# Altium project SAMV71_Xplained_Ultra.PrjPCB (part 2 of 4)

## Sheet SAMV71_Xplained_Ultra_Connectors.SchDoc: Extension connectors
size A3; Organization: ATMEL Norway; Address1: Vestre Rosten 79; Address2: N-7075 TILLER; Address3: NORWAY; DocumentNumber: A09-2407; Revision: 2; SheetNumber: 7; SheetTotal: 13; PageSetup: Record=PageOptions|CenterHorizontal=True|CenterVertical=True|PrintScale=1.01|XCorrection=1.00|YCorrection=1.00|PrintKind=1|BorderSize=5000000|LeftOffset=0|BottomOffset=0|Orientation=2|PaperLength=1000|PaperWidth=1000|Scale=100|PaperSource=7|PrintQuality=-4|MediaType=1|DitherType=10|PrintScaleMode=1|PaperKind=A3 (297 x 420 mm)|PaperIndex=9
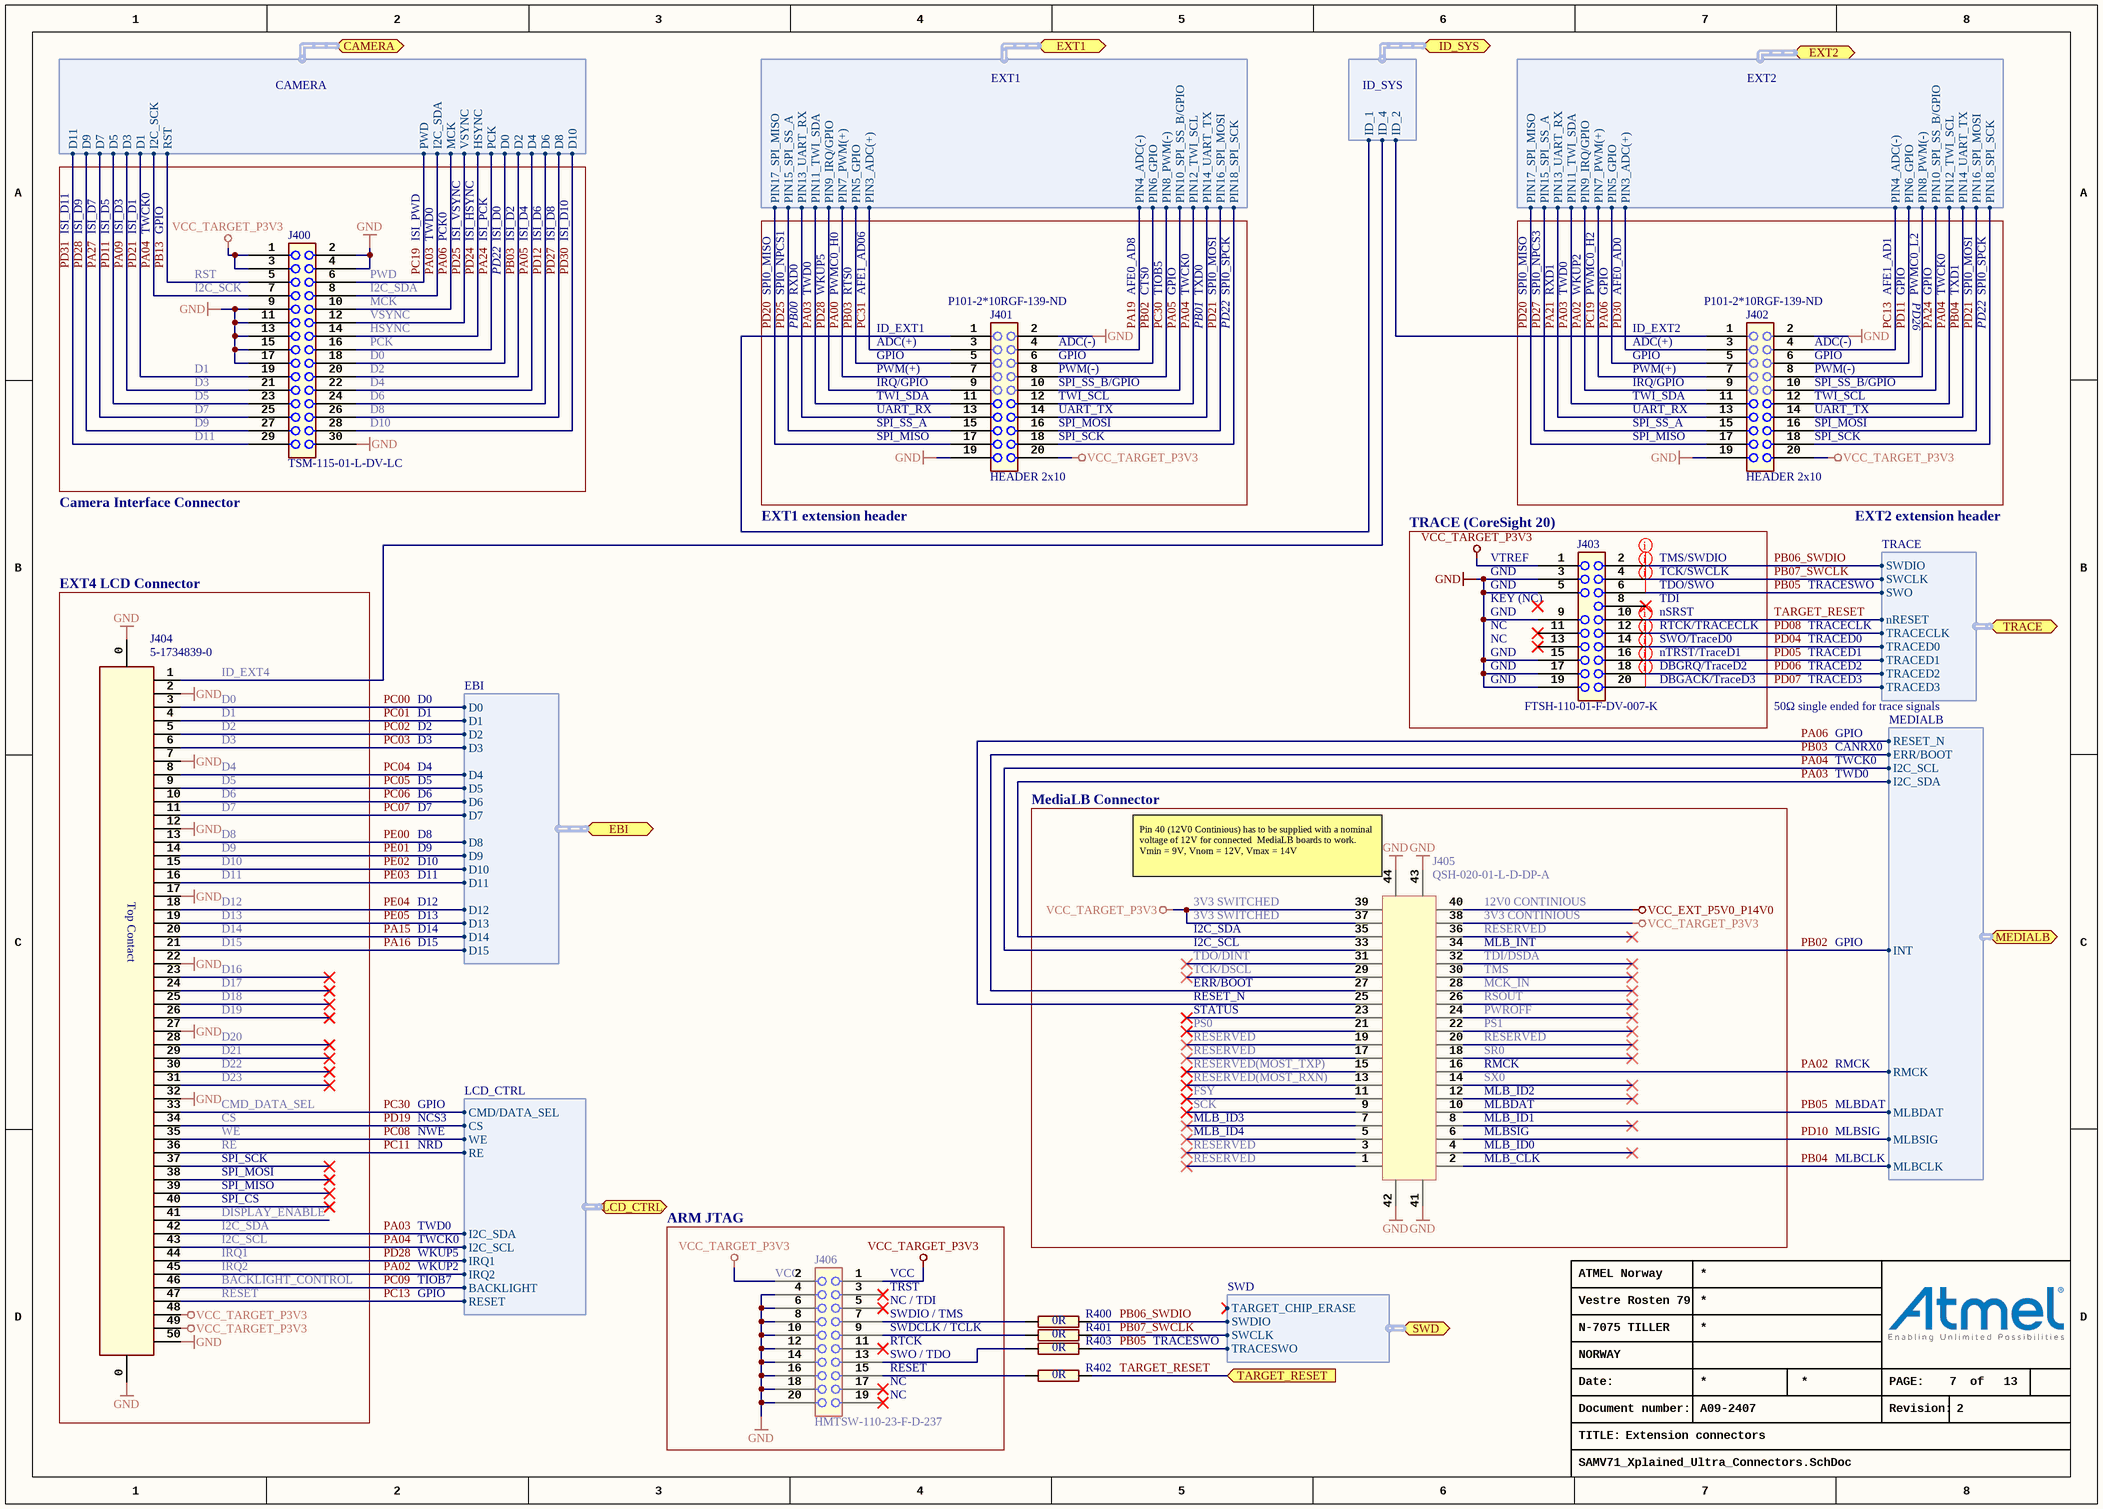
[diagram p3: SAMV71_Xplained_Ultra_Connectors.SchDoc]

### Parts
J400  value TSM-115-01-L-DV-LC  [AP8-00884]  (hidden comment: HEADER 2x15)
J401  HEADER 2x10  value P101-2*10RGF-139-ND  [AP8-00622]
J402  HEADER 2x10  value P101-2*10RGF-139-ND  [AP8-00622]
J403  FTSH-110-01-F-DV-007-K  [AP8-00910]
J404  value 5-1734839-0  [AP8-00774]  (hidden comment: Used for Xplained Pro MCU board on top layer.)
J405  value QSH-020-01-L-D-DP-A  [AP8-00878]
J406  value HMTSW-110-23-F-D-237  [AP8-00744]  (hidden comment: Same as A08-1514 but with 1mm hole)
R400  value 0R  [AP2-00000]  (hidden comment: R2)
R401  value 0R  [AP2-00000]  (hidden comment: R2)
R402  value 0R  [AP2-00000]  (hidden comment: R2)
R403  value 0R  [AP2-00000]  (hidden comment: R2)

### Blocks framed on the sheet
TRACE (CoreSight 20): J403
EXT4 LCD Connector: J404
MediaLB Connector: J405
ARM JTAG: J406

### Ports
CAMERA (harness CAMERA), EBI (harness EBI), EXT1 (harness EXT1), EXT2 (harness EXT2), ID_SYS (harness ID_SYS), LCD_CTRL (harness LCD_CTRL), MEDIALB (harness MEDIALB), SWD (harness SWD), TARGET_RESET (in), TRACE (harness TRACE)

### Harnesses
ID_SYS: ID_1, ID_2, ID_4
EXT1: PIN3_ADC(+), PIN4_ADC(-), PIN5_GPIO, PIN6_GPIO, PIN7_PWM(+), PIN8_PWM(-), PIN9_IRQ/GPIO, PIN10_SPI_SS_B/GPIO, PIN11_TWI_SDA, PIN12_TWI_SCL, PIN13_UART_RX, PIN14_UART_TX, PIN15_SPI_SS_A, PIN16_SPI_MOSI, PIN17_SPI_MISO, PIN18_SPI_SCK
EXT2: PIN3_ADC(+), PIN4_ADC(-), PIN5_GPIO, PIN6_GPIO, PIN7_PWM(+), PIN8_PWM(-), PIN9_IRQ/GPIO, PIN10_SPI_SS_B/GPIO, PIN11_TWI_SDA, PIN12_TWI_SCL, PIN13_UART_RX, PIN14_UART_TX, PIN15_SPI_SS_A, PIN16_SPI_MOSI, PIN17_SPI_MISO, PIN18_SPI_SCK
EBI: D0, D1, D2, D3, D4, D5, D6, D7, D8, D9, D10, D11, D12, D13, D14, D15
CAMERA: MCK, VSYNC, HSYNC, PCK, D0, D1, D2, D3, D4, D5, D6, D7, D8, D9, D10, D11, I2C_SCK, I2C_SDA, RST, PWD
TRACE: SWDIO, SWCLK, TRACECLK, TRACED0, TRACED1, TRACED2, TRACED3, nRESET, SWO
LCD_CTRL: CMD/DATA_SEL, CS, WE, RE, I2C_SDA, I2C_SCL, IRQ1, IRQ2, BACKLIGHT, RESET
MEDIALB: MLBSIG, MLBDAT, MLBCLK, I2C_SDA, I2C_SCL, INT, ERR/BOOT, RESET_N, RMCK
SWD: SWCLK, SWDIO, TARGET_CHIP_ERASE, TRACESWO

### Nets
GND: J400.2 J400.4 J400.9 J400.11 J400.13 J400.15 J400.17 J400.30 J401.2 J401.19 J402.2 J402.19 J403.3 J403.5 J403.9 J403.15 J403.17 J403.19 J404.0 J404.2 J404.7 J404.12 J404.17 J404.22 J404.27 J404.32 J404.50 J405.41 J405.42 J405.43 J405.44 J406.4 J406.6 J406.8 J406.10 J406.12 J406.14 J406.16 J406.18 J406.20
VCC_EXT_P5V0_P14V0: J405.40
VCC_TARGET_P3V3: J400.1 J400.3 J401.20 J402.20 J403.1 J404.48 J404.49 J405.37 J405.38 J405.39 J406.1 J406.2
ID1: J401.1 ; port ID_SYS.ID_1
ID2: J402.1 ; port ID_SYS.ID_2
ID4: J404.1 ; port ID_SYS.ID_4
PA00: J401.7 ; port EXT1.PIN7_PWM(+)
PA02: J402.9 J404.45 J405.16 ; port EXT2.PIN9_IRQ/GPIO, port LCD_CTRL.IRQ2, port MEDIALB.RMCK
PA03: J400.8 J401.11 J402.11 J404.42 J405.35 ; port EXT1.PIN11_TWI_SDA, port EXT2.PIN11_TWI_SDA, port CAMERA.I2C_SDA, port LCD_CTRL.I2C_SDA, port MEDIALB.I2C_SDA
PA04: J400.7 J401.12 J402.12 J404.43 J405.33 ; port EXT1.PIN12_TWI_SCL, port EXT2.PIN12_TWI_SCL, port CAMERA.I2C_SCK, port LCD_CTRL.I2C_SCL, port MEDIALB.I2C_SCL
PA05: J400.22 J401.10 ; port EXT1.PIN10_SPI_SS_B/GPIO, port CAMERA.D4
PA06: J400.10 J402.5 J405.25 ; port EXT2.PIN5_GPIO, port CAMERA.MCK, port MEDIALB.RESET_N
PA09: J400.21 ; port CAMERA.D3
PA15: J404.20 ; port EBI.D14
PA16: J404.21 ; port EBI.D15
PA19: J401.4 ; port EXT1.PIN4_ADC(-)
PA21: J402.13 ; port EXT2.PIN13_UART_RX
PA24: J400.16 J402.10 ; port EXT2.PIN10_SPI_SS_B/GPIO, port CAMERA.PCK
PA27: J400.25 ; port CAMERA.D7
PB02: J401.6 J405.34 ; port EXT1.PIN6_GPIO, port MEDIALB.INT
PB03: J400.20 J401.5 J405.27 ; port EXT1.PIN5_GPIO, port CAMERA.D2, port MEDIALB.ERR/BOOT
PB04: J402.14 J405.2 ; port EXT2.PIN14_UART_TX, port MEDIALB.MLBCLK
PB05: J403.6 J405.10 R403.2 ; port TRACE.SWO, port MEDIALB.MLBDAT, port SWD.TRACESWO
PB06_SWDIO: J403.2 R400.2 ; port TRACE.SWDIO, port SWD.SWDIO
PB07_SWCLK: J403.4 R401.2 ; port TRACE.SWCLK, port SWD.SWCLK
PB13: J400.5 ; port CAMERA.RST
PC00: J404.3 ; port EBI.D0
PC01: J404.4 ; port EBI.D1
PC02: J404.5 ; port EBI.D2
PC03: J404.6 ; port EBI.D3
PC04: J404.8 ; port EBI.D4
PC05: J404.9 ; port EBI.D5
PC06: J404.10 ; port EBI.D6
PC07: J404.11 ; port EBI.D7
PC08: J404.35 ; port LCD_CTRL.WE
PC09: J404.46 ; port LCD_CTRL.BACKLIGHT
PC11: J404.36 ; port LCD_CTRL.RE
PC13: J402.4 J404.47 ; port EXT2.PIN4_ADC(-), port LCD_CTRL.RESET
PC19: J400.6 J402.7 ; port EXT2.PIN7_PWM(+), port CAMERA.PWD
PC30: J401.8 J404.33 ; port EXT1.PIN8_PWM(-), port LCD_CTRL.CMD/DATA_SEL
PC31: J401.3 ; port EXT1.PIN3_ADC(+)
PD04: J403.14 ; port TRACE.TRACED0
PD05: J403.16 ; port TRACE.TRACED1
PD06: J403.18 ; port TRACE.TRACED2
PD07: J403.20 ; port TRACE.TRACED3
PD08: J403.12 ; port TRACE.TRACECLK
PD10: J405.6 ; port MEDIALB.MLBSIG
PD11: J400.23 J402.6 ; port EXT2.PIN6_GPIO, port CAMERA.D5
PD12: J400.24 ; port CAMERA.D6
PD19: J404.34 ; port LCD_CTRL.CS
PD20: J401.17 J402.17 ; port EXT1.PIN17_SPI_MISO, port EXT2.PIN17_SPI_MISO
PD21: J400.19 J401.16 J402.16 ; port EXT1.PIN16_SPI_MOSI, port EXT2.PIN16_SPI_MOSI, port CAMERA.D1
PD24: J400.14 ; port CAMERA.HSYNC
PD25: J400.12 J401.15 ; port EXT1.PIN15_SPI_SS_A, port CAMERA.VSYNC
PD27: J400.26 J402.15 ; port EXT2.PIN15_SPI_SS_A, port CAMERA.D8
PD28: J400.27 J401.9 J404.44 ; port EXT1.PIN9_IRQ/GPIO, port CAMERA.D9, port LCD_CTRL.IRQ1
PD30: J400.28 J402.3 ; port EXT2.PIN3_ADC(+), port CAMERA.D10
PD31: J400.29 ; port CAMERA.D11
PE00: J404.13 ; port EBI.D8
PE01: J404.14 ; port EBI.D9
PE02: J404.15 ; port EBI.D10
PE03: J404.16 ; port EBI.D11
PE04: J404.18 ; port EBI.D12
PE05: J404.19 ; port EBI.D13
TARGET_RESET: J403.10 R402.2 ; port TARGET_RESET, port TRACE.nRESET
NetJ400_18: J400.18 ; port CAMERA.D0
NetJ401_13: J401.13 ; port EXT1.PIN13_UART_RX
NetJ401_14: J401.14 ; port EXT1.PIN14_UART_TX
NetJ401_18: J401.18 ; port EXT1.PIN18_SPI_SCK
NetJ402_8: J402.8 ; port EXT2.PIN8_PWM(-)
NetJ402_18: J402.18 ; port EXT2.PIN18_SPI_SCK
NetJ406_7: J406.7 R400.1
NetJ406_9: J406.9 R401.1
NetJ406_13: J406.13 R403.1
NetJ406_15: J406.15 R402.1

Not connected (* = marked no-connect by the designer): J403 8* 11* 13*; J404 23* 24* 25* 26* 28* 29* 30* 31* 37* 38* 39* 40* 41; J405 1* 3* 4* 5* 7* 8* 9* 11* 12* 13* 14* 15* 17* 18* 19* 20* 21* 22* 23* 24* 26* 28* 29* 30* 31* 32* 36*; J406 3* 5* 11* 17* 19*

### Layout directives
net class TRACE: PB05, PB06_SWDIO, PB07_SWCLK, PD04, PD05, PD06, PD07, PD08

### Notes on the sheet
- ISI_D11
- ISI_D9
- ISI_D7
- ISI_D5
- ISI_D3
- ISI_D1
- TWCK0
- GPIO
- ISI_PWD
- TWD0
- PCK0
- ISI_VSYNC
- ISI_HSYNC
- ISI_PCK
- ISI_D0
- ISI_D2
- ISI_D4
- ISI_D6
- ISI_D8
- ISI_D10
- RST
- (near J400) I2C_SCK
- PWD
- I2C_SDA
- MCK
- VSYNC
- PD22
- SPI0_MISO
- SPI0_NPCS1
- RXD0
- WKUP5
- PWMC0_H0
- RTS0
- AFE1_AD06
- AFE0_AD8
- CTS0
- TIOB5
- TXD0
- SPI0_MOSI
- SPI0_SPCK
- SPI0_NPCS3
- RXD1
- WKUP2
- PWMC0_H2
- AFE0_AD0
- AFE1_AD1
- PD26
- PWMC0_L2
- TXD1
- D1
- HSYNC
- PCK
- D0
- D2
- PB00
- ID_EXT1
- ADC(+)
- PWM(+)
- (near J401) ADC(-)
- (near J401) GPIO
- (near J401) PWM(-)
- PB01
- ID_EXT2
- (near J402) ADC(-)
- (near J402) GPIO
- (near J402) PWM(-)
- D3
- D5
- D7
- D9
- D11
- D4
- D6
- D8
- D10
- IRQ/GPIO
- TWI_SDA
- UART_RX
- SPI_SS_A
- SPI_MISO
- (near J401) SPI_SS_B/GPIO
- (near J401) TWI_SCL
- (near J401) UART_TX
- (near J401) SPI_MOSI
- (near J401) SPI_SCK
- (near J402) SPI_SS_B/GPIO
- (near J402) TWI_SCL
- (near J402) UART_TX
- (near J402) SPI_MOSI
- (near J402) SPI_SCK
- Camera Interface Connector
- EXT1 extension header
- VTREF
- GND
- TMS/SWDIO
- TCK/SWCLK
- TDO/SWO
- TRACESWO
- EXT2 extension header
- (near J403) KEY (NC)
- NC
- TDI
- nSRST
- SWO/TraceD0
- RTCK/TRACECLK
- TRACECLK
- TRACED0
- ID_EXT4
- nTRST/TraceD1
- DBGRQ/TraceD2
- DBGACK/TraceD3
- 50Ω single ended for trace signals
- TRACED1
- TRACED2
- TRACED3
- CANRX0
- D12
- D13
- (near J405) Pin 40 (12V0 Continious) has to be supplied with a nominal voltage of 12V for connected  MediaLB boards to work.  Vmin = 9V, Vnom = 12V, Vmax = 14V
- 3V3 SWITCHED
- (near J405) 3V3 CONTINIOUS
- (near J405) 12V0 CONTINIOUS
- D14
- D15
- D16
- D17
- TCK/DSCL
- TDO/DINT
- ERR/BOOT
- I2C_SCL
- (near J405) TMS
- (near J405) TDI/DSDA
- (near J405) RESERVED
- (near J405) MCK_IN
- (near J405) MLB_INT
- D18
- D19
- D20
- D21
- RESERVED
- PS0
- STATUS
- RESET_N
- (near J405) SR0
- (near J405) RSOUT
- (near J405) PWROFF
- (near J405) PS1
- D22
- D23
- CMD_DATA_SEL
- CS
- NCS3
- SCK
- FSY
- RESERVED(MOST_RXN)
- RESERVED(MOST_TXP)
- MLB_ID3
- (near J405) SX0
- (near J405) RMCK
- (near J405) MLBDAT
- (near J405) MLB_ID2
- (near J405) MLB_ID1
- RMCK
- MLBDAT
- WE
- RE
- SPI_MOSI
- SPI_SCK
- NWE
- NRD
- MLB_ID4
- (near J405) MLBSIG
- (near J405) MLB_ID0
- (near J405) MLB_CLK
- MLBSIG
- MLBCLK
- DISPLAY_ENABLE
- IRQ1
- SPI_CS
- IRQ2
- BACKLIGHT_CONTROL
- RESET
- TIOB7
- (near J406) VCC
- (near J406) TRST
- (near J406) NC / TDI
- (near J406) SWDIO / TMS
- SWDCLK / TCLK
- (near J406) RTCK
- (near J406) SWO / TDO
- (near J406) RESET
- (near J406) NC
- Date:
- PAGE:
- of
- TITLE:
- Document number:
- Revision:
- (in symbol A08-1886) Top Contact

### Library data of the parts
J400 = A08-2225: Samtec TSM series, 2x15 pin header, straight, 2.54mm pitch SMD, locking leads.; PartGroup: Mechanical devices,Connectors,Pin headers; TemperatureRange: -55Â°C to +125Â°C; AN: A08-2225; Height: 9,64999961853027
J401 J402 = A08-1513: Pin header, 2x10, Right Angle, 2.54mm, THM, Pin In Paste; PartGroup: Mechanical devices,Connectors,Pin headers; AN: A08-1513; MPN: P101-2*10RGF-139-ND
J403 = A08-2290: SAMTEC FTSH series 50-mil header, shrouded, pin 7 removed, SMD; PartGroup: Mechanical devices,Connectors,Pin headers; TemperatureRange: -55Â°C to +125Â°C; AN: A08-2290; Value: FTSH-110-01-F-DV-007-K; Height: 6,1100001335144
J404 = A08-1886: 50 pin FPC connector, e=0.5mm, single side contact (top).; PartGroup: Mechanical devices,Connectors,PCB - receptacle; Manufacturer: TE Connectivity; TemperatureRange: -20°C to +85°C; AN: A08-1886; Height: 2.04999995231628; MPN: 5-1734839-0
J405 = A08-2204: SAMTEC 0.5mm, 20-pair, High-Speed Differential Pair Socket; PartGroup: Mechanical devices,Connectors,PCB - receptacle; AN: A08-2204; Height: 3.04999995231628
J406 = A08-1801: 2x10 pin header, 2.54mm pitch, Pin-in-Paste THM, 1mm hole; PartGroup: Mechanical devices,Connectors,Pin headers; Manufacturer: SAMTEC; AN: A08-1801; Height: 6,09999990463257; MPN: HMTSW-110-23-F-D-237
R400-R403 = A02-0163: RES 0.0 OHM 1/16W 0402 SMD; PartGroup: Resistors,SMD,0402 1%; Manufacturer: (n/a); MPN: RMCF0402ZT0R00; Tolerance: 1 %; TemperatureRange: -55 - +125 deg C; AN: A02-0163; Height: 0,349999994039536

## Sheet SAMV71_Xplained_Ultra_Power_Supply.SchDoc: Power supply
size A3; Organization: ATMEL Norway; Address1: Vestre Rosten 79; Address2: N-7075 TILLER; Address3: NORWAY; DocumentNumber: A09-2407; Revision: 2; SheetNumber: 2; SheetTotal: 13; PageSetup: Record=PageOptions|CenterHorizontal=True|CenterVertical=True|PrintScale=1.01|XCorrection=1.00|YCorrection=1.00|PrintKind=1|BorderSize=5000000|LeftOffset=0|BottomOffset=0|Orientation=2|PaperLength=1000|PaperWidth=1000|Scale=100|PaperSource=7|PrintQuality=-4|MediaType=1|DitherType=10|PaperKind=A3 (297 x 420 mm)|PrintScaleMode=1
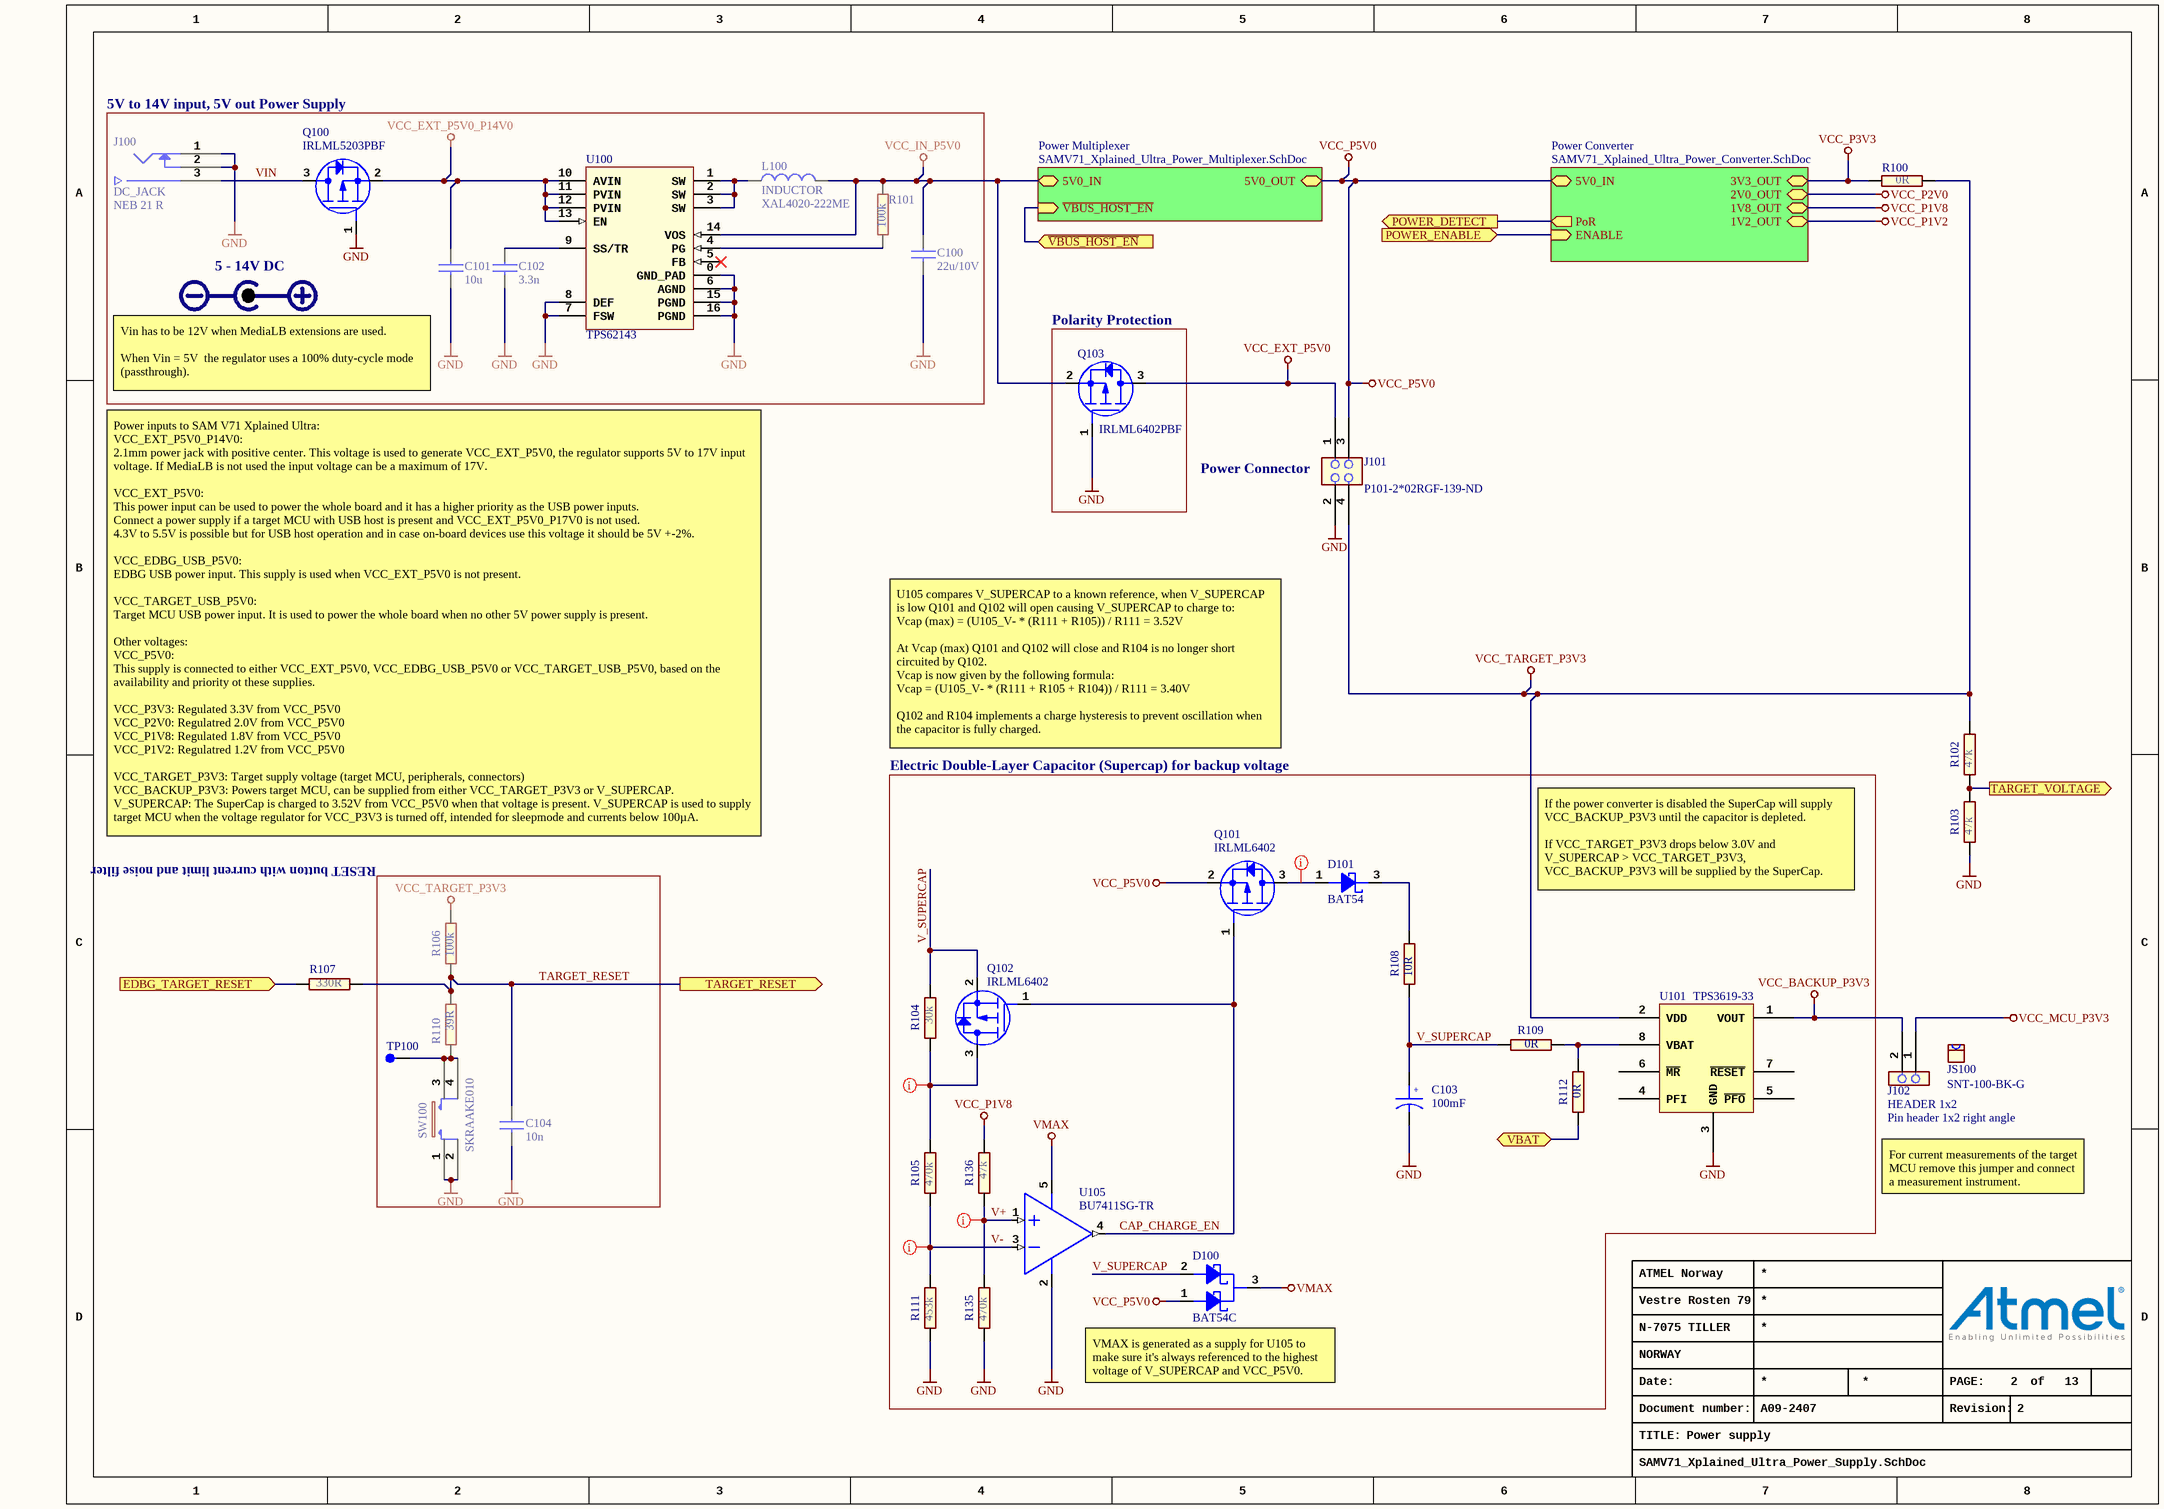
[diagram p4: SAMV71_Xplained_Ultra_Power_Supply.SchDoc]

### Parts
C100  value 22u/10V  [AP1-00003]  (hidden comment: CAP-NONPOL)
C101  value 10u  [AP1-00003]  (hidden comment: CAP-NONPOL)
C102  value 3.3n  [AP1-00001]  (hidden comment: CAP-NONPOL)
C103  value 100mF  [AP1-00122]  (hidden comment: For reflow soldering)
C104  10n  [AP1-00053]
D100  value BAT54C  [AP5-00002]  (hidden comment: DUAL_SCHOTTKY_123)
D101  value BAT54  [AP4-00007]  (hidden comment: SCHOTTKY_SMD_31)
J100  DC_JACK  value NEB 21 R  [AP8-00853]
J101  value P101-2*02RGF-139-ND  [AP8-00628]  (hidden comment: HEADER 2x2)
J102  HEADER 1x2  value Pin header 1x2 right angle  [AP8-00367]
JS100  value SNT-100-BK-G  [AP8-00525]
L100  INDUCTOR  value XAL4020-222ME  [AP3-00119]
Q100  value IRLML5203PBF  [AP5-00002]  (hidden comment: MOSFET_P_GSD)
Q101  value IRLML6402  [AP5-00002]  (hidden comment: MOSFET_P_GSD)
Q102  value IRLML6402  [AP5-00002]  (hidden comment: MOSFET_P_GSD)
Q103  value IRLML6402PBF  [AP5-00002]  (hidden comment: MOSFET_P_GSD)
R100  value 0R  [AP2-00000]  (hidden comment: R2)
R101  value 100k  [AP2-00000]  (hidden comment: R2)
R102  value 47k  [AP2-00000]  (hidden comment: R2)
R103  value 47k  [AP2-00000]  (hidden comment: R2)
R104  value 30k  [AP2-00000]  (hidden comment: R2)
R105  value 470k  [AP2-00000]  (hidden comment: R2)
R106  value 100k  [AP2-00011]  (hidden comment: R2)
R107  value 330R  [AP2-00011]  (hidden comment: R2)
R108  value 10R  [AP2-00000]  (hidden comment: R2)
R109  value 0R  [AP2-00000]  (hidden comment: R2)
R110  value 39R  [AP2-00011]  (hidden comment: R2)
R111  value 453k  [AP2-00000]  (hidden comment: R2)
R112  value 0R  [AP2-00000]  (hidden comment: R2)
R135  value 470k  [AP2-00000]  (hidden comment: R2)
R136  value 47k  [AP2-00000]  (hidden comment: ?)
SW100  value SKRAAKE010  [AP8-00137]  (hidden comment: Can be ordered in low volumes from Mouser)
TP100  TESTPOINT  [AP8-00010]  (value not drawn)  (no BOM)
U100  value TPS62143  [AP6-00313]  (hidden comment: 100% duty-cycle mode, supports input voltage close to 5V with 5V output!)
U101  TPS3619-33  [AP6-00382]
U105  value BU7411SG-TR  [AP6-00087]

### Blocks framed on the sheet
Polarity Protection: Q103
RESET button with current limit and noise filter: C104 R106 R110 SW100 TP100

### Sub-sheets
Power Converter = SAMV71_Xplained_Ultra_Power_Converter.SchDoc: 2V0_OUT (bidir), 3V3_OUT, 5V0_IN, 1V2_OUT, 1V8_OUT, ENABLE (in), PoR (out)
Power Multiplexer = SAMV71_Xplained_Ultra_Power_Multiplexer.SchDoc: ~{VBUS_HOST_EN} (in), 5V0_OUT, 5V0_IN

### Ports
EDBG_TARGET_RESET (in), POWER_DETECT (out), POWER_ENABLE (in), TARGET_RESET (out), TARGET_VOLTAGE (out), VBAT (bidir), ~{VBUS_HOST_EN} (in)

### Nets
GND: C100.2 C101.2 C102.2 C103.2 C104.2 J100.1 J100.2 J101.2 Q100.1(G) Q103.1(G) R103.1 R111.1 R135.1 SW100.1 SW100.2 U100.0(GND_PAD) U100.6(AGND) U100.7(FSW) U100.8(DEF) U100.15(PGND) U100.16(PGND) U101.3(GND) U105.2(GND)
VCC_BACKUP_P3V3: J102.2 U101.1(VOUT)
VCC_EXT_P5V0: J101.1 Q103.3(D)
VCC_EXT_P5V0_P14V0: C101.1 Q100.2(S) U100.10(AVIN) U100.11(PVIN) U100.12(PVIN) U100.13(EN)
VCC_IN_P5V0: C100.1 L100.2 Q103.2(S) R101.1 U100.14(VOS) ; sheet Power Multiplexer/5V0_IN
VCC_MCU_P3V3: J102.1
VCC_P1V8: R136.2 ; sheet Power Converter/1V8_OUT
VCC_P3V3: R100.1 ; sheet Power Converter/3V3_OUT
VCC_P5V0: D100.1(ANODE1) J101.3 Q101.2(S) ; sheet Power Multiplexer/5V0_OUT, sheet Power Converter/5V0_IN
VCC_TARGET_P3V3: J101.4 R100.2 R102.2 R106.2 U101.2(VDD)
VMAX: D100.3(CATHODE) U105.5(VCC)
CAP_CHARGE_EN: Q101.1(G) Q102.1(G) U105.4(OUT)
EDBG_ADC0: R102.1 R103.2 ; port TARGET_VOLTAGE
EDBG_TARGET_RESET: R107.1 ; port EDBG_TARGET_RESET
PA01: port POWER_DETECT, sheet Power Converter/PoR
PC16: port ~{VBUS_HOST_EN}, sheet Power Multiplexer/~{VBUS_HOST_EN}
PC17: port POWER_ENABLE, sheet Power Converter/ENABLE
TARGET_RESET: C104.1 R106.1 R107.2 R110.2 ; port TARGET_RESET
V+: R135.2 R136.1 U105.1(IN+)
V-: R105.1 R111.2 U105.3(IN-)
V_SUPERCAP: C103.1 D100.2(ANODE2) Q102.2(S) R104.2 R108.2 R109.1
VBAT: R112.1 ; port VBAT
VIN: J100.3 Q100.3(D)
NetC102_1: C102.1 U100.9(SS/TR)
NetD101_1: D101.1(ANODE) Q101.3(D)
NetD101_3: D101.3(CATHODE) R108.1
NetL100_1: L100.1 U100.1(SW) U100.2(SW) U100.3(SW)
NetQ102_3: Q102.3(D) R104.1 R105.2
NetR101_2: R101.2 U100.4(PG)
NetR109_2: R109.2 R112.2 U101.8(VBAT)
NetR110_1: R110.1 SW100.3 SW100.4 TP100.1

Not connected (* = marked no-connect by the designer): U100 5(FB)*; U101 4(PFI) 5(~{PFO}) 6(~{MR}) 7(~{RESET})

### Layout directives
rule Fabrication Testpoint Usage [Testpoint - Not Allowed    Multiple - Not Allowed]; rule Assembly Testpoint Usage [Testpoint - Not Allowed    Multiple - Not Allowed]: NetD101_1, NetQ102_3, V+, V-

### Notes on the sheet
- (near J100) 5V to 14V input, 5V out Power Supply
- (near Q100) 5 - 14V DC
- (near C101) Vin has to be 12V when MediaLB extensions are used.
  When Vin = 5V  the regulator uses a 100% duty-cycle mode (passthrough).
- (near J101) Power Connector
- Electric Double-Layer Capacitor (Supercap) for backup voltage
- U105 compares V_SUPERCAP to a known reference, when V_SUPERCAP is low Q101 and Q102 will open causing V_SUPERCAP to charge to:
  Vcap (max) = (U105_V- * (R111 + R105)) / R111 = 3.52V
  At Vcap (max) Q101 and Q102 will close and R104 is no longer short circuited by Q102.
  Vcap is now given by the following formula:
  Vcap = (U105_V- * (R111 + R105 + R104)) / R111 = 3.40V
  Q102 and R104 implements a charge hysteresis to prevent oscillation when the capacitor is fully charged.
- Power inputs to SAM V71 Xplained Ultra:
  VCC_EXT_P5V0_P14V0:
  2.1mm power jack with positive center. This voltage is used to generate VCC_EXT_P5V0, the regulator supports 5V to 17V input voltage. If MediaLB is not used the input voltage can be a maximum of 17V.
  VCC_EXT_P5V0:
  This power input can be used to power the whole board and it has a higher priority as the USB power inputs.
  Connect a power supply if a target MCU with USB host is present and VCC_EXT_P5V0_P17V0 is not used.
  4.3V to 5.5V is possible but for USB host operation and in case on-board devices use this voltage it should be 5V +-2%.
  VCC_EDBG_USB_P5V0:
  EDBG USB power input. This supply is used when VCC_EXT_P5V0 is not present.
  VCC_TARGET_USB_P5V0:
  Target MCU USB power input. It is used to power the whole board when no other 5V power supply is present.
  Other voltages:
  VCC_P5V0:
  This supply is connected to either VCC_EXT_P5V0, VCC_EDBG_USB_P5V0 or VCC_TARGET_USB_P5V0, based on the availability and priority ot these supplies.
  VCC_P3V3: Regulated 3.3V from VCC_P5V0
  VCC_P2V0: Regulatred 2.0V from VCC_P5V0
  VCC_P1V8: Regulated 1.8V from VCC_P5V0
  VCC_P1V2: Regulatred 1.2V from VCC_P5V0
  VCC_TARGET_P3V3: Target supply voltage (target MCU, peripherals, connectors)
  VCC_BACKUP_P3V3: Powers target MCU, can be supplied from either VCC_TARGET_P3V3 or V_SUPERCAP.
  V_SUPERCAP: The SuperCap is charged to 3.52V from VCC_P5V0 when that voltage is present. V_SUPERCAP is used to supply target MCU when the voltage regulator for VCC_P3V3 is turned off, intended for sleepmode and currents below 100µA.
- If the power converter is disabled the SuperCap will supply VCC_BACKUP_P3V3 until the capacitor is depleted.
  If VCC_TARGET_P3V3 drops below 3.0V and V_SUPERCAP > VCC_TARGET_P3V3, VCC_BACKUP_P3V3 will be supplied by the SuperCap.
- For current measurements of the target MCU remove this jumper and connect a measurement instrument.
- (near D100) VMAX is generated as a supply for U105 to make sure it's always referenced to the highest voltage of V_SUPERCAP and VCC_P5V0.
- Date:
- PAGE:
- of
- TITLE:
- Document number:
- Revision:
- (in symbol A01-0679) +

### Library data of the parts
C100 = A01-0500: Ceramic capacitor, SMD 0805, X5R, 10V, Â±20%; PartGroup: Capacitors,Ceramic,SMD 0805; Manufacturer: tdk; MPN: C2012X5R1A226M/0.85; TemperatureRange: -55Â°C to +85Â°C; AN: A01-0500; Height: 0,949999988079071
C101 = A01-0634: Ceramic capacitor, SMD 0805, X5R, 25V, Â±10%; PartGroup: Capacitors,Ceramic,SMD 0805; Manufacturer: Murata; MPN: GRM21BR61E106KA73L; TemperatureRange: -55 Â°C to +85 Â°C; AN: A01-0634; Tolerance: Â±10%; Height: 1.25
C102 = A01-0044: Ceramic capacitor, SMD 0402, X7R, 25V, +/-10%; PartGroup: Capacitors,Ceramic,SMD 0402; TemperatureRange: -55 - +125 deg C; AN: A01-0044; Tolerance: 25V, +/-10%; Height: 0.550000011920929
C103 = A01-0679: Electric Double-Layer (Supercapacitor), 100mF, SMD, 10.5mm diameter, 25Î© ESR; PartGroup: Capacitors,Other; Tolerance: -20/+80%; TemperatureRange: -25Â°C to +70Â°C; AN: A01-0679
C104 = A01-0050: Ceramic capacitor, SMD 0402, X7R, 25V, +/-10%; PartGroup: Capacitors,Ceramic,SMD 0402; TemperatureRange: -55 - +125 deg C; AN: A01-0050; Value: 10n; Tolerance: 25V, +/-10%; Height: 0,550000011920929
D100 = A04-0064: Schottky double Diodes, NXP, SOT23-3; PartGroup: Diodes,Schottky; AN: A04-0064; Height: 1; Manufacturer: NXP; MPN: BAT54C
D101 = A04-0001: Schottky diode, V(rrm)=30V, I(f)=0.1A, V(f)=0.4V (at If = 0.01A), I(r)=0.5uA (at Vrrm), t(rr)=5ns, SMD SOT23; PartGroup: Diodes,Schottky; Manufacturer: Philips; NC: 2; TemperatureRange: -40 - +85 deg C; AN: A04-0001; Height: 1,10000002384186; MPN: BAT54
J100 = A08-2120: Through hole DC jack 2.1mm, 12V, 3A; PartGroup: Mechanical devices,Connectors,Power; Manufacturer: Lumberg; TemperatureRange: -20Â°C to +70Â°C; AN: A08-2120; Height: 11; MPN: NEB 21 R
J101 = A08-1519: Pin header, 2x2, Right Angle, 2.54mm, THT, Pin In Paste; PartGroup: Mechanical devices,Connectors,Pin headers; AN: A08-1519; Height: 5.07999992370605; MPN: P101-2*02RGF-139-ND
J102 = A08-0764: 1x2 pin header, right angle, 2.54 mm pitch, through-hole; PartGroup: Mechanical devices,Connectors,Pin headers; Manufacturer: Pro-data International Corp; MPN: 2213R-2G; AN: A08-0764; Height: 2.53999996185303
JS100 = A08-0543: Jumper cap for 2.54mm pinheader; PartGroup: Mechanical devices,Mounting accessories,Other; Manufacturer: SAMTEC; AN: A08-0543; MPN: SNT-100-BK-G
L100 = A03-0197: 2.2ÂµH Shielded Power Inductor, 4x4x2mm, Isat=5.6A , Irms=4.0A , DCR=35.2mÎ©; PartGroup: Inductors,Power Inductors; Tolerance: 20%; TemperatureRange: â€“40Â°C to +125Â°C; AN: A03-0197; Height: 2
Q100 = A05-0023: P-ch. MOSFET. -30V, -3.0A continuous, -24A Peak. RDS(ON)=0.098Ohm@VGS=-10V, RDS(ON)=0.165Ohm@VGS=-4.5V, -2.5V<VGS(th)<-1.0V; PartGroup: Transistors,Power FET,SMD; Manufacturer: International Rectifier; TemperatureRange: -40C to +125; AN: A05-0023; Height: 1,12000000476837; MPN: IRLML5203PBF
Q101 Q102 = A05-0087: P-ch. MOSFET. -30V, -3.7A continuous,RDS(ON)=0.05Ohm@VGS=-4,5V, RDS(ON)=0.08Ohm@VGS=-2.5V; PartGroup: Transistors,Power FET,SMD; Manufacturer: International Rectifier; MPN: IRLML6402PBF; TemperatureRange: -55 - +150 deg C; AN: A05-0087; Height: 1,14999997615814
Q103 = A05-0087: P-ch. MOSFET. -30V, -3.7A continuous,RDS(ON)=0.05Ohm@VGS=-4,5V, RDS(ON)=0.08Ohm@VGS=-2.5V; PartGroup: Transistors,Power FET,SMD; Manufacturer: International Rectifier; TemperatureRange: -55 - +150 deg C; AN: A05-0087; Height: 1.14999997615814; MPN: IRLML6402PBF
R100 = A02-0163: Thick film resistor, SMD 0402, 1/16W, 1%; PartGroup: Resistors,SMD,0402 1%; TemperatureRange: -55 - +125 deg C; AN: A02-0163; Tolerance: 1 %; Height: 0.349999994039536
R101 = A02-0260: Thick film resistor, SMD 0402, 1/16W, 1%; PartGroup: Resistors,SMD,0402 1%; TemperatureRange: -55ï¿½ to +125ï¿½C; AN: A02-0260; Tolerance: 1 %; Height: 0.349999994039536
R102 R103 R136 = A02-0252: Thick film resistor, SMD 0402, 1/16W, 1%; PartGroup: Resistors,SMD,0402 1%; TemperatureRange: -55 - +125 deg C; AN: A02-0252; Tolerance: 1 %
  R102 R103: Height: 0.349999994039536
  R136: Height: 0,349999994039536
R104 = A02-0247: Thick film resistor, SMD 0402, 1/16W, 1%; PartGroup: Resistors,SMD,0402 1%; TemperatureRange: -55ï¿½ to +155ï¿½C; AN: A02-0247; Tolerance: 1 %; Height: 0,349999994039536
R105 R135 = A02-0276: Thick film resistor, SMD 0402, 1/16W, 1%; PartGroup: Resistors,SMD,0402 1%; TemperatureRange: -55 - +125 deg C; AN: A02-0276; Tolerance: 1 %; Height: 0,349999994039536
R106 = A02-0260: Thick film resistor, SMD 0402, 1/16W, 1%; PartGroup: Resistors,SMD,0402 1%; TemperatureRange: -55 - +125 deg C; AN: A02-0260; Tolerance: 1 %; Height: 0,349999994039536
R107 = A02-0200: Thick film resistor, SMD 0402, 1/16W, 1%; PartGroup: Resistors,SMD,0402 1%; TemperatureRange: -55 - +125 deg C; AN: A02-0200; Tolerance: 1 %; Height: 0,349999994039536
R108 = A02-0164: Thick film resistor, SMD 0402, 1/16W, 1%; PartGroup: Resistors,SMD,0402 1%; TemperatureRange: -55ï¿½ to +125ï¿½C; AN: A02-0164; Tolerance: 1 %; Height: 0.349999994039536
R109 R112 = A02-0163: as R400-R403 on sheet SAMV71_Xplained_Ultra_Connectors; AN: A02-0163; Height: 0.349999994039536
R110 = A02-0178: Thick film resistor, SMD 0402, 1/16W, 1%; PartGroup: Resistors,SMD,0402 1%; TemperatureRange: -55 - +125 deg C; AN: A02-0178; Tolerance: 1 %; Height: 0,349999994039536
R111 = A02-0925: Thick film resistor, SMD 0402, 1/16W, 1%; PartGroup: Resistors,SMD,0402 1%; TemperatureRange: -55 - +125 deg C; AN: A02-0925; Tolerance: 1 %; Height: 0,349999994039536
SW100 = A08-0790: 6.2x6.2 mm SMD tact switch, same as A08-0091 but less force is needed; PartGroup: Mechanical devices,Switches,SMD; Manufacturer: ALPS; TemperatureRange: -30 - +90 deg C; AN: A08-0790; Height: 5,09999990463257; MPN: SKRAAKE010
TP100 = A08-0004: Single SMD testpad; PartGroup: Mechanical devices,Connectors,Test points; AN: A08-0004; Height: 0
U100 = A06-1167: 5V to 17V in, 5V 2A out, Step-Down Converter; PartGroup: Integrated Circuits,Regulators,Switched; TemperatureRange: -40C to 85C; AN: A06-1167; Height: 1
U101 = A06-1100: Backup battery supervisors for RAM retention; PartGroup: Integrated Circuits,Special function,Supervisor; Manufacturer: Texas Instruments; MPN: TPS3619-33DGK; Design comment: *; AN: A06-1100; Value: TPS3619-33
U105 = A06-1239: Single, Low Voltage (1.6-5.5V), Low Power (0.35ÂµA), low cost; PartGroup: Integrated Circuits,General linear,OP-AMP; TemperatureRange: -40Â°C to +105Â°C; AN: A06-1239; Height: 1,25

## Sheet SAMV71_Xplained_Ultra_Power_Multiplexer.SchDoc: Power Multiplexer
size A3; Organization: ATMEL Norway; Address1: Vestre Rosten 79; Address2: N-7075 TILLER; Address3: NORWAY; DocumentNumber: A09-2407; Revision: 2; SheetNumber: 3; SheetTotal: 13; PageSetup: Record=PageOptions|CenterHorizontal=True|CenterVertical=True|PrintScale=1.01|XCorrection=1.00|YCorrection=1.00|PrintKind=1|BorderSize=5000000|LeftOffset=0|BottomOffset=0|Orientation=2|PaperLength=1000|PaperWidth=1000|Scale=100|PaperSource=7|PrintQuality=-4|MediaType=1|DitherType=10|PaperKind=A3 (297 x 420 mm)|PrintScaleMode=1
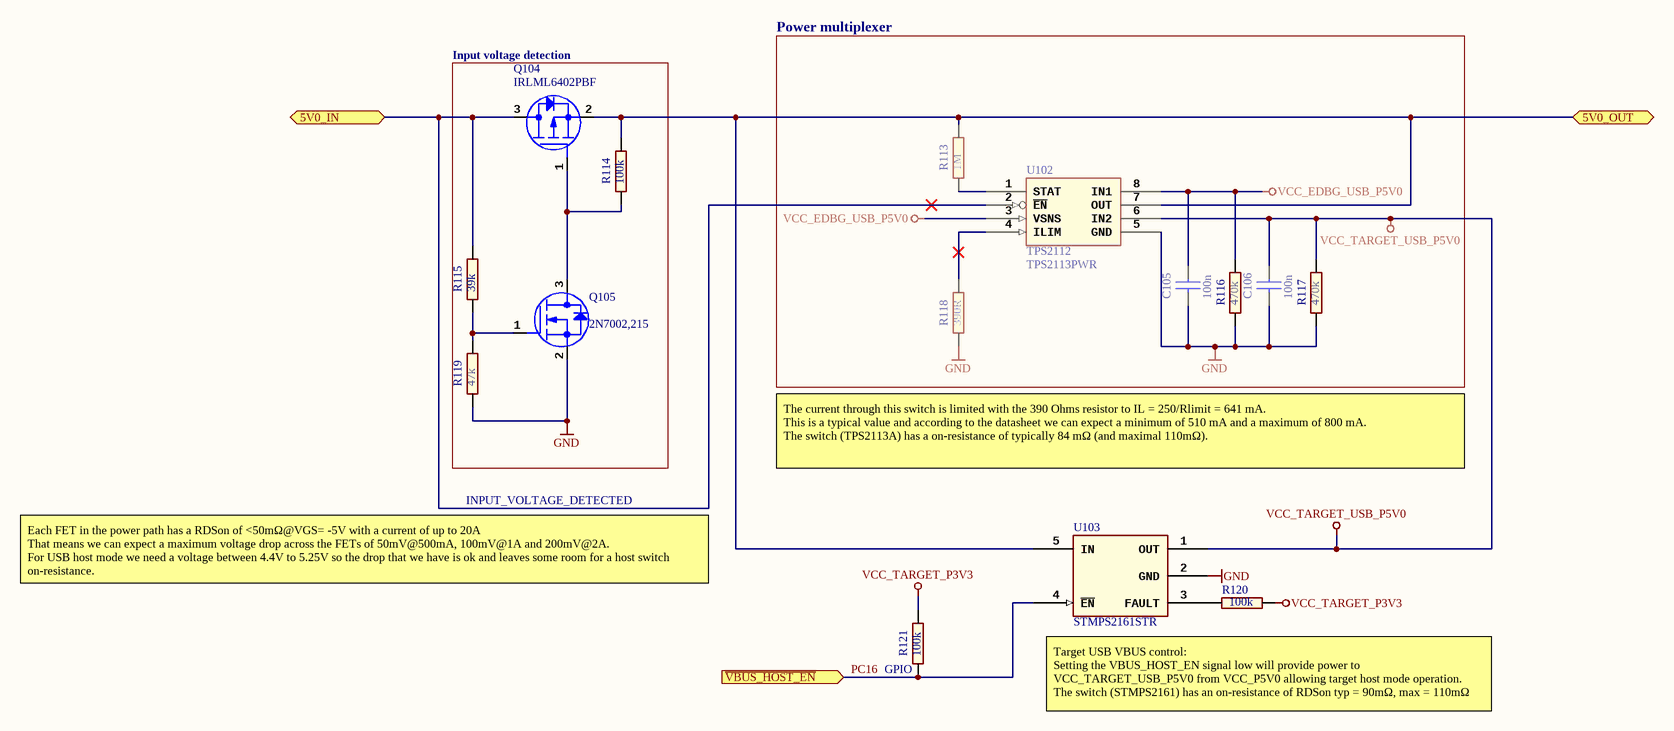
[diagram p5: SAMV71_Xplained_Ultra_Power_Multiplexer.SchDoc]

### Parts
C105  value 100n  [AP1-00001]  (hidden comment: CAP-NONPOL)
C106  value 100n  [AP1-00001]  (hidden comment: CAP-NONPOL)
Q104  value IRLML6402PBF  [AP5-00002]  (hidden comment: MOSFET_P_GSD)
Q105  value 2N7002,215  [AP5-00002]  (hidden comment: MOSFET_N_GSD)
R113  value 1M  [AP2-00000]  (hidden comment: R2)
R114  value 100k  [AP2-00000]  (hidden comment: R2)
R115  value 39k  [AP2-00000]  (hidden comment: R2)
R116  value 470k  [AP2-00000]  (hidden comment: R2)
R117  value 470k  [AP2-00000]  (hidden comment: R2)
R118  value 390R  [AP2-00000]  (hidden comment: R2)
R119  value 47k  [AP2-00000]  (hidden comment: R2)
R120  value 100k  [AP2-00011]  (hidden comment: R2)
R121  value 100k  [AP2-00011]  (hidden comment: R2)
U102  TPS2112  value TPS2113PWR  [AP6-00054]
U103  value STMPS2161STR  [AP6-00087]  (hidden comment: STMPS2161)

### Blocks framed on the sheet
Input voltage detection: Q104 Q105 R114 R115 R119
Power multiplexer: C105 C106 R113 R116-R118 U102

### Ports
5V0_IN, 5V0_OUT, ~{VBUS_HOST_EN} (in)

### Nets
GND: C105.2 C106.2 Q105.2(S) R116.1 R117.1 R118.1 R119.1 U102.5(GND) U103.2(GND)
VCC_EDBG_USB_P5V0: C105.1 R116.2 U102.3(VSNS) U102.8(IN1)
VCC_IN_P5V0: Q104.3(D) R115.2 U102.2(~{EN}) ; port 5V0_IN
VCC_P5V0: Q104.2(S) R113.2 R114.2 U102.7(OUT) U103.5(IN) ; port 5V0_OUT
VCC_TARGET_P3V3: R120.1 R121.2
VCC_TARGET_USB_P5V0: C106.1 R117.2 U102.6(IN2) U103.1(OUT)
PC16: R121.1 U103.4(~{EN}) ; port ~{VBUS_HOST_EN}
NetQ104_1: Q104.1(G) Q105.3(D) R114.1
NetQ105_1: Q105.1(G) R115.1 R119.2
NetR113_1: R113.1 U102.1(STAT)
NetR118_2: R118.2 U102.4(ILIM)
NetR120_2: R120.2 U103.3(FAULT)

### Notes on the sheet
- The current through this switch is limited with the 390 Ohms resistor to IL = 250/Rlimit = 641 mA.
  This is a typical value and according to the datasheet we can expect a minimum of 510 mA and a maximum of 800 mA.
  The switch (TPS2113A) has a on-resistance of typically 84 mΩ (and maximal 110mΩ).
- INPUT_VOLTAGE_DETECTED
- Each FET in the power path has a RDSon of <50mΩ@VGS= -5V with a current of up to 20A
  That means we can expect a maximum voltage drop across the FETs of 50mV@500mA, 100mV@1A and 200mV@2A.
  For USB host mode we need a voltage between 4.4V to 5.25V so the drop that we have is ok and leaves some room for a host switch on-resistance.
- (near R121) GPIO
- Target USB VBUS control:
  Setting the VBUS_HOST_EN signal low will provide power to VCC_TARGET_USB_P5V0 from VCC_P5V0 allowing target host mode operation.
  The switch (STMPS2161) has an on-resistance of RDSon typ = 90mΩ, max = 110mΩ
- Date:
- PAGE:
- of
- TITLE:
- Document number:
- Revision:

### Library data of the parts
C105 C106 = A01-0246: Ceramic capacitor, SMD 0402, X7R, 16V, +/-10%; PartGroup: Capacitors,Ceramic,SMD 0402; Manufacturer: Kemet; MPN: C0402C104K4RACTU; TemperatureRange: -55 - +125 deg C; AN: A01-0246; Tolerance: 16V, +/-10%; Height: 0.5
Q104 = A05-0087: as Q103 on sheet SAMV71_Xplained_Ultra_Power_Supply; AN: A05-0087; Height: 1.14999997615814; MPN: IRLML6402PBF
Q105 = A05-0085: N-Channel MOSFET. 60V, 0.300A continuous, 1.2A Peak. RDS(ON) = 3.8Ohm@VGS=4.5V, VGS(th)<2.5V; PartGroup: Transistors,Small signal FET,SMD; Manufacturer: NXP; TemperatureRange: -65 to 150 deg C; AN: A05-0085; Height: 1.10000002384186; MPN: 2N7002,215
R113 = A02-0284: Thick film resistor, SMD 0402, 1/16W, 1%; PartGroup: Resistors,SMD,0402 1%; TemperatureRange: -55 - +125 deg C; AN: A02-0284; Tolerance: 1 %; Height: 0.349999994039536
R114 R120 R121 = A02-0260: as R106 on sheet SAMV71_Xplained_Ultra_Power_Supply; AN: A02-0260; Tolerance: 1 %; Height: 0.349999994039536
R115 = A02-0250: Thick film resistor, SMD 0402, 1/16W, 1%; PartGroup: Resistors,SMD,0402 1%; TemperatureRange: -55 - +125 deg C; AN: A02-0250; Tolerance: 1 %; Height: 0,349999994039536
R116 R117 = A02-0276: as R105 on sheet SAMV71_Xplained_Ultra_Power_Supply; AN: A02-0276; Tolerance: 1 %; Height: 0,349999994039536
R118 = A02-0202: Thick film resistor, SMD 0402, 1/16W, 1%; PartGroup: Resistors,SMD,0402 1%; TemperatureRange: -55 - +125 deg C; AN: A02-0202; Tolerance: 1 %; Height: 0.349999994039536
R119 = A02-0252: as R102 on sheet SAMV71_Xplained_Ultra_Power_Supply; AN: A02-0252; Tolerance: 1 %; Height: 0,349999994039536
U102 = A06-0068: Autoswitching 2:1 Power Mux; PartGroup: Integrated Circuits,General linear,Analog switch, bus switch and MUX; Manufacturer: Texas Instruments; TemperatureRange: -40 - + 125 deg C; AN: A06-0068; Height: 1.20000004768372; MPN: TPS2113PWR
U103 = A06-1087: Single channel power switch, 1A, reverse block, active low enabled.; PartGroup: Integrated Circuits,General linear,Analog switch, bus switch and MUX; Tolerance: 2.7 to 5.5V; TemperatureRange: -40Â°C to +85Â°C; Design comment: *; AN: A06-1087; Height: 1,45000004768372

## Sheet SAMV71_Xplained_Ultra_Power_Converter.SchDoc: Power Converter
size A3; Organization: ATMEL Norway; Address1: Vestre Rosten 79; Address2: N-7075 TILLER; Address3: NORWAY; DocumentNumber: A09-2407; Revision: 2; SheetNumber: 4; SheetTotal: 13; PageSetup: Record=PageOptions|CenterHorizontal=True|CenterVertical=True|PrintScale=1.01|XCorrection=1.00|YCorrection=1.00|PrintKind=1|BorderSize=5000000|LeftOffset=0|BottomOffset=0|Orientation=2|PaperLength=1000|PaperWidth=1000|Scale=100|PaperSource=7|PrintQuality=-4|MediaType=1|DitherType=10|PaperKind=A3 (297 x 420 mm)|PrintScaleMode=1
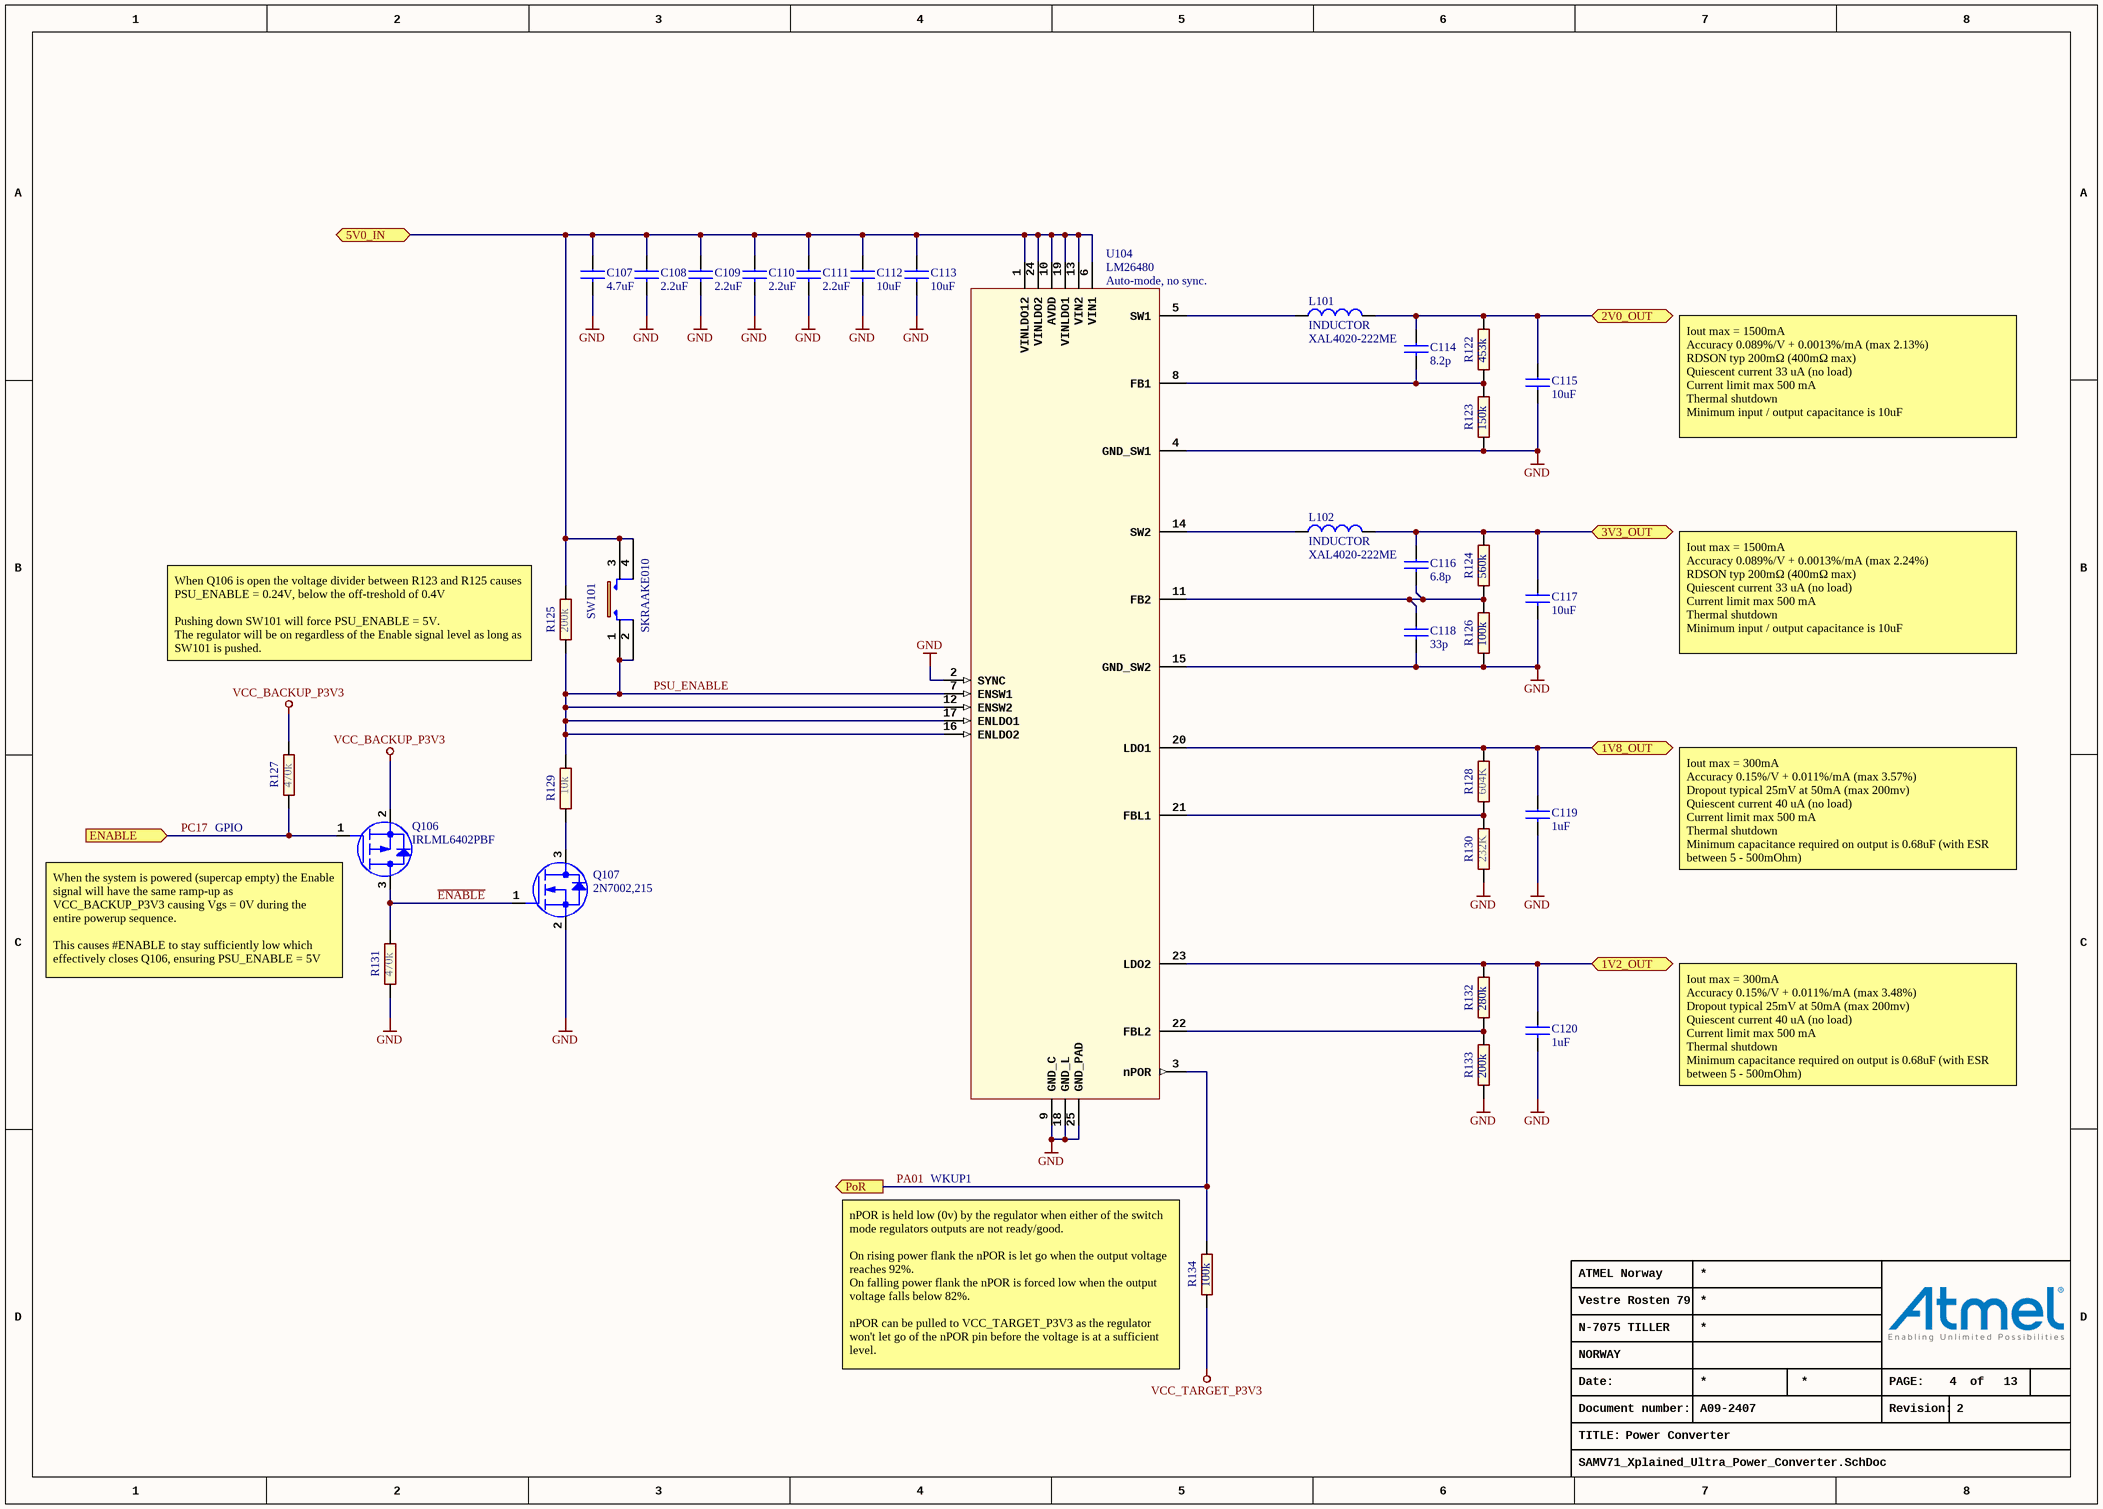
[diagram p6: SAMV71_Xplained_Ultra_Power_Converter.SchDoc]

### Parts
C107  value 4.7uF  [AP1-00039]  (hidden comment: CAP-NONPOL)
C108  value 2.2uF  [AP1-00053]  (hidden comment: Farnell no: 1288200)
C109  value 2.2uF  [AP1-00053]  (hidden comment: Farnell no: 1288200)
C110  value 2.2uF  [AP1-00053]  (hidden comment: Farnell no: 1288200)
C111  value 2.2uF  [AP1-00053]  (hidden comment: Farnell no: 1288200)
C112  value 10uF  [AP1-00041]
C113  value 10uF  [AP1-00041]
C114  value 8.2p  [AP1-00053]  (hidden comment: CAP-NONPOL)
C115  value 10uF  [AP1-00041]
C116  value 6.8p  [AP1-00053]  (hidden comment: CAP-NONPOL)
C117  value 10uF  [AP1-00041]
C118  value 33p  [AP1-00053]  (hidden comment: CAP-NONPOL)
C119  value 1uF  [AP1-00053]  (hidden comment: CAP-NONPOL)
C120  value 1uF  [AP1-00053]  (hidden comment: CAP-NONPOL)
L101  INDUCTOR  value XAL4020-222ME  [AP3-00119]
L102  INDUCTOR  value XAL4020-222ME  [AP3-00119]
Q106  value IRLML6402PBF  [AP5-00002]  (hidden comment: MOSFET_P_GSD)
Q107  value 2N7002,215  [AP5-00002]  (hidden comment: MOSFET_N_GSD)
R122  value 453k  [AP2-00011]  (hidden comment: R2)
R123  value 150k  [AP2-00011]  (hidden comment: R2)
R124  value 560k  [AP2-00011]  (hidden comment: R2)
R125  value 200k  [AP2-00011]  (hidden comment: R2)
R126  value 100k  [AP2-00011]  (hidden comment: R2)
R127  value 470k  [AP2-00011]  (hidden comment: R2)
R128  value 604K  [AP2-00011]  (hidden comment: R2)
R129  value 10k  [AP2-00011]  (hidden comment: R2)
R130  value 232K  [AP2-00011]  (hidden comment: R2)
R131  value 470k  [AP2-00011]  (hidden comment: R2)
R132  value 280k  [AP2-00011]  (hidden comment: R2)
R133  value 200k  [AP2-00011]  (hidden comment: R2)
R134  value 100k  [AP2-00011]  (hidden comment: R2)
SW101  value SKRAAKE010  [AP8-00137]  (hidden comment: Can be ordered in low volumes from Mouser)
U104  Auto-mode, no sync.  value LM26480  [AP6-00380]

### Ports
1V2_OUT, 1V8_OUT, 2V0_OUT (bidir), 3V3_OUT, 5V0_IN, ENABLE (in), PoR (out)

### Nets
GND: C107.2 C108.2 C109.2 C110.2 C111.2 C112.2 C113.2 C115.2 C117.2 C118.2 C119.2 C120.2 Q107.2(S) R123.1 R126.2 R130.1 R131.1 R133.1 U104.2(SYNC) U104.4(GND_SW1) U104.9(GND_C) U104.15(GND_SW2) U104.18(GND_L) U104.25(GND_PAD)
VCC_BACKUP_P3V3: Q106.2(S) R127.2
VCC_P1V2: C120.1 R132.2 U104.23(LDO2) ; port 1V2_OUT
VCC_P1V8: C119.1 R128.2 U104.20(LDO1) ; port 1V8_OUT
VCC_P2V0: C114.1 C115.1 L101.2 R122.2 ; port 2V0_OUT
VCC_P3V3: C116.1 C117.1 L102.2 R124.2 ; port 3V3_OUT
VCC_P5V0: C107.1 C108.1 C109.1 C110.1 C111.1 C112.1 C113.1 R125.2 SW101.3 SW101.4 U104.1(VINLDO12) U104.6(VIN1) U104.10(AVDD) U104.13(VIN2) U104.19(VINLDO1) U104.24(VINLDO2) ; port 5V0_IN
VCC_TARGET_P3V3: R134.2
~{ENABLE}: Q106.3(D) Q107.1(G) R131.2
PA01: R134.1 U104.3(nPOR) ; port PoR
PC17: Q106.1(G) R127.1 ; port ENABLE
PSU_ENABLE: R125.1 R129.2 SW101.1 SW101.2 U104.7(ENSW1) U104.12(ENSW2) U104.16(ENLDO2) U104.17(ENLDO1)
NetC114_2: C114.2 R122.1 R123.2 U104.8(FB1)
NetC116_2: C116.2 C118.1 R124.1 R126.1 U104.11(FB2)
NetL101_1: L101.1 U104.5(SW1)
NetL102_1: L102.1 U104.14(SW2)
NetQ107_3: Q107.3(D) R129.1
NetR128_1: R128.1 R130.2 U104.21(FBL1)
NetR132_1: R132.1 R133.2 U104.22(FBL2)

### Notes on the sheet
- Iout max = 1500mA
  Accuracy 0.089%/V + 0.0013%/mA (max 2.13%)
  RDSON typ 200mΩ (400mΩ max)
  Quiescent current 33 uA (no load)
  Current limit max 500 mA
  Thermal shutdown
  Minimum input / output capacitance is 10uF
- Iout max = 1500mA
  Accuracy 0.089%/V + 0.0013%/mA (max 2.24%)
  RDSON typ 200mΩ (400mΩ max)
  Quiescent current 33 uA (no load)
  Current limit max 500 mA
  Thermal shutdown
  Minimum input / output capacitance is 10uF
- (near R125) When Q106 is open the voltage divider between R123 and R125 causes PSU_ENABLE = 0.24V, below the off-treshold of 0.4V
  Pushing down SW101 will force PSU_ENABLE = 5V.
  The regulator will be on regardless of the Enable signal level as long as SW101 is pushed.
- GPIO
- Iout max = 300mA
  Accuracy 0.15%/V + 0.011%/mA (max 3.57%)
  Dropout typical 25mV at 50mA (max 200mv)
  Quiescent current 40 uA (no load)
  Current limit max 500 mA
  Thermal shutdown
  Minimum capacitance required on output is 0.68uF (with ESR between 5 - 500mOhm)
- (near Q106) When the system is powered (supercap empty) the Enable signal will have the same ramp-up as VCC_BACKUP_P3V3 causing Vgs = 0V during the entire powerup sequence.
  This causes #ENABLE to stay sufficiently low which effectively closes Q106, ensuring PSU_ENABLE = 5V
- Iout max = 300mA
  Accuracy 0.15%/V + 0.011%/mA (max 3.48%)
  Dropout typical 25mV at 50mA (max 200mv)
  Quiescent current 40 uA (no load)
  Current limit max 500 mA
  Thermal shutdown
  Minimum capacitance required on output is 0.68uF (with ESR between 5 - 500mOhm)
- WKUP1
- (near R134) nPOR is held low (0v) by the regulator when either of the switch mode regulators outputs are not ready/good.
  On rising power flank the nPOR is let go when the output voltage reaches 92%.
  On falling power flank the nPOR is forced low when the output voltage falls below 82%.
  nPOR can be pulled to VCC_TARGET_P3V3 as the regulator won't let go of the nPOR pin before the voltage is at a sufficient level.
- Date:
- PAGE:
- of
- TITLE:
- Document number:
- Revision:

### Library data of the parts
C107 = A01-0377: Ceramic capacitor, SMD 0603, X5R, 10V, 10% (de31036); PartGroup: Capacitors,Ceramic,SMD 0603; Manufacturer: tdk; MPN: C1608X5R1A475K; TemperatureRange: -55 - +85 deg C; AN: A01-0377; Tolerance: 10%; Height: 0.800000011920929
C108-C111 = A01-0300: Ceramic capacitor, SMD 0402, X5R, 6.3V, +/-20%; PartGroup: Capacitors,Ceramic,SMD 0402; Manufacturer: Kemet; MPN: C0402C225M9PAC; Tolerance: Â±20%; TemperatureRange: -55Â°C to +85Â°C; AN: A01-0300; Height: 0.5
C112 C113 C115 C117 = A01-0360: Ceramic capacitor, SMD 0805, X5R, 10V, 10 %, (de19441); PartGroup: Capacitors,Ceramic,SMD 0805; Manufacturer: Murata; MPN: GRM21BR61A106KE19L; Tolerance: 10%; TemperatureRange: -55 - +85 deg C; AN: A01-0360; Height: 1.25
C114 = A01-0014: Ceramic capacitor, SMD 0402, NP0, 50V, +/-5%; PartGroup: Capacitors,Ceramic,SMD 0402; TemperatureRange: -55 - +125 deg C; AN: A01-0014; Tolerance: 50V, +/-5%; Height: 0.550000011920929
C116 = A01-0013: Ceramic capacitor, SMD 0402, NP0, 50V, +/-5%; PartGroup: Capacitors,Ceramic,SMD 0402; TemperatureRange: -55 - +125 deg C; AN: A01-0013; Tolerance: 50V, +/-5%; Height: 0.550000011920929
C118 = A01-0021: Ceramic capacitor, SMD 0402, NP0, 50V, +/-5%; PartGroup: Capacitors,Ceramic,SMD 0402; TemperatureRange: -55 - +125 deg C; AN: A01-0021; Tolerance: 50V, +/-5%; Height: 0.550000011920929
C119 C120 = A01-0447: Ceramic capacitor, SMD 0402, X5R, 10V, ±10 %; PartGroup: Capacitors,Ceramic,SMD 0402; Manufacturer: AVX; MPN: 0402ZD105KAT2A; AN: A01-0447; Height: 0.560000002384186
L101 L102 = A03-0197: as L100 on sheet SAMV71_Xplained_Ultra_Power_Supply; AN: A03-0197; Height: 2
Q106 = A05-0087: as Q103 on sheet SAMV71_Xplained_Ultra_Power_Supply; AN: A05-0087; Height: 1.14999997615814; MPN: IRLML6402PBF
Q107 = A05-0085: as Q105 on sheet SAMV71_Xplained_Ultra_Power_Multiplexer; AN: A05-0085; Height: 1.10000002384186; MPN: 2N7002,215
R122 = A02-0925: as R111 on sheet SAMV71_Xplained_Ultra_Power_Supply; AN: A02-0925; Tolerance: 1 %; Height: 0,349999994039536
R123 = A02-0264: Thick film resistor, SMD 0402, 1/16W, 1%; PartGroup: Resistors,SMD,0402 1%; TemperatureRange: -55 - +125 deg C; AN: A02-0264; Tolerance: 1 %; Height: 0.349999994039536
R124 = A02-0278: Thick film resistor, SMD 0402, 1/16W, 1%; PartGroup: Resistors,SMD,0402 1%; TemperatureRange: -55 - +125 deg C; AN: A02-0278; Tolerance: 1 %; Height: 0.349999994039536
R125 R133 = A02-0267: Thick film resistor, SMD 0402, 1/16W, 1%; PartGroup: Resistors,SMD,0402 1%; TemperatureRange: -55 - +125 deg C; AN: A02-0267; Tolerance: 1 %; Height: 0,349999994039536
R126 R134 = A02-0260: as R101 on sheet SAMV71_Xplained_Ultra_Power_Supply; AN: A02-0260; Tolerance: 1 %; Height: 0.349999994039536
R127 R131 = A02-0276: as R105 on sheet SAMV71_Xplained_Ultra_Power_Supply; AN: A02-0276; Tolerance: 1 %; Height: 0,349999994039536
R128 = A02-0923: Thick film resistor, SMD 0402, 1/16W, 1%; PartGroup: Resistors,SMD,0402 1%; TemperatureRange: -55 - +125 deg C; AN: A02-0923; Tolerance: 1 %; Height: 0,349999994039536
R129 = A02-0236: Thick film resistor, SMD 0402, 1/16W, 1%; PartGroup: Resistors,SMD,0402 1%; Manufacturer: vishay; MPN: CRCW040210K0FKED; TemperatureRange: -55 - +125 deg C; AN: A02-0236; Tolerance: 1 %; Height: 0,349999994039536
R130 = A02-0927: Thick film resistor, SMD 0402, 1/16W, 1%; PartGroup: Resistors,SMD,0402 1%; TemperatureRange: -55Â°C to +150Â°C; AN: A02-0927; Height: 0,349999994039536; Tolerance: 1 %
R132 = A02-0924: Thick film resistor, SMD 0402, 1/16W, 1%; PartGroup: Resistors,SMD,0402 1%; TemperatureRange: -55 - +125 deg C; AN: A02-0924; Tolerance: 1 %; Height: 0,349999994039536
SW101 = A08-0790: as SW100 on sheet SAMV71_Xplained_Ultra_Power_Supply; AN: A08-0790; Height: 5,09999990463257; MPN: SKRAAKE010
U104 = A06-1165: Externally Programmable Dual High-Current Step-Down DC/DC and Dual Linear Regulators; PartGroup: Integrated Circuits,Regulators,Switched; TemperatureRange: -40C to 85C; AN: A06-1165; Height: 0,800000011920929